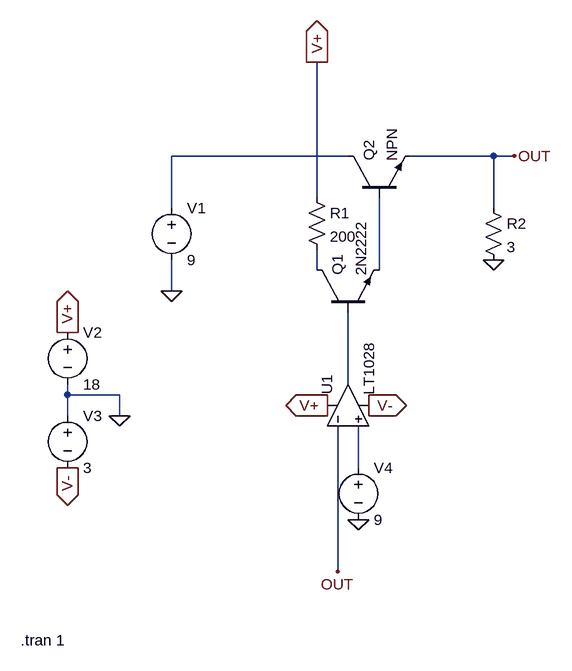
[diagram p0: schematic pass_darlington.asc]
pass_darlington.asc, the LTspice schematic file:
Version 4
SHEET 1 880 828
WIRE 240 64 -32 64
WIRE 464 64 336 64
WIRE 496 64 464 64
WIRE 192 128 192 -80
WIRE -32 144 -32 64
WIRE 464 144 464 64
WIRE 192 240 192 208
WIRE 288 240 288 128
WIRE -32 272 -32 224
WIRE 240 416 240 304
WIRE -192 432 -192 416
WIRE -112 432 -192 432
WIRE -192 464 -192 432
WIRE -112 464 -112 432
WIRE 256 544 256 480
WIRE 224 704 224 480
FLAG -32 272 0
FLAG 464 224 0
FLAG -112 464 0
FLAG -192 336 V+
IOPIN -192 336 Out
FLAG 208 448 V+
IOPIN 208 448 Out
FLAG 272 448 V-
IOPIN 272 448 Out
FLAG -192 544 V-
IOPIN -192 544 Out
FLAG 224 704 OUT
FLAG 496 64 OUT
FLAG 256 624 0
FLAG 192 -80 V+
IOPIN 192 -80 Out
SYMBOL npn 192 304 R270
SYMATTR InstName Q1
SYMATTR Value 2N2222
SYMBOL voltage -32 128 R0
WINDOW 123 0 0 Left 2
WINDOW 39 0 0 Left 2
SYMATTR InstName V1
SYMATTR Value 9
SYMBOL res 448 128 R0
SYMATTR InstName R2
SYMATTR Value 3
SYMBOL Opamps\\LT1028 176 448 R270
SYMATTR InstName U1
SYMBOL voltage -192 320 R0
WINDOW 123 0 0 Left 2
WINDOW 39 0 0 Left 2
SYMATTR InstName V2
SYMATTR Value 18
SYMBOL voltage -192 448 R0
WINDOW 123 0 0 Left 2
WINDOW 39 0 0 Left 2
SYMATTR InstName V3
SYMATTR Value 3
SYMBOL voltage 256 528 R0
WINDOW 123 0 0 Left 2
WINDOW 39 0 0 Left 2
SYMATTR InstName V4
SYMATTR Value 9
SYMBOL npn 240 128 R270
SYMATTR InstName Q2
SYMBOL res 176 112 R0
SYMATTR InstName R1
SYMATTR Value 200
TEXT -264 810 Left 2 !.tran 1

The netlist it stands for:
* pass_darlington.asc
Q1 N002 N004 N003 0 2N2222
V1 N001 0 9
R2 OUT 0 3
XU1 N005 OUT V+ V- N004 LT1028  ; pins In+ In- V+ V- OUT
V2 V+ 0 18
V3 0 V- 3
V4 N005 0 9
Q2 N001 N003 OUT 0 NPN
R1 V+ N002 200
.model NPN NPN
.model PNP PNP
.lib standard.bjt
.tran 1
.lib LTC.lib
.backanno
.end